# EAGLE design SI7021-V1.0 (EAGLE 6.6.0)
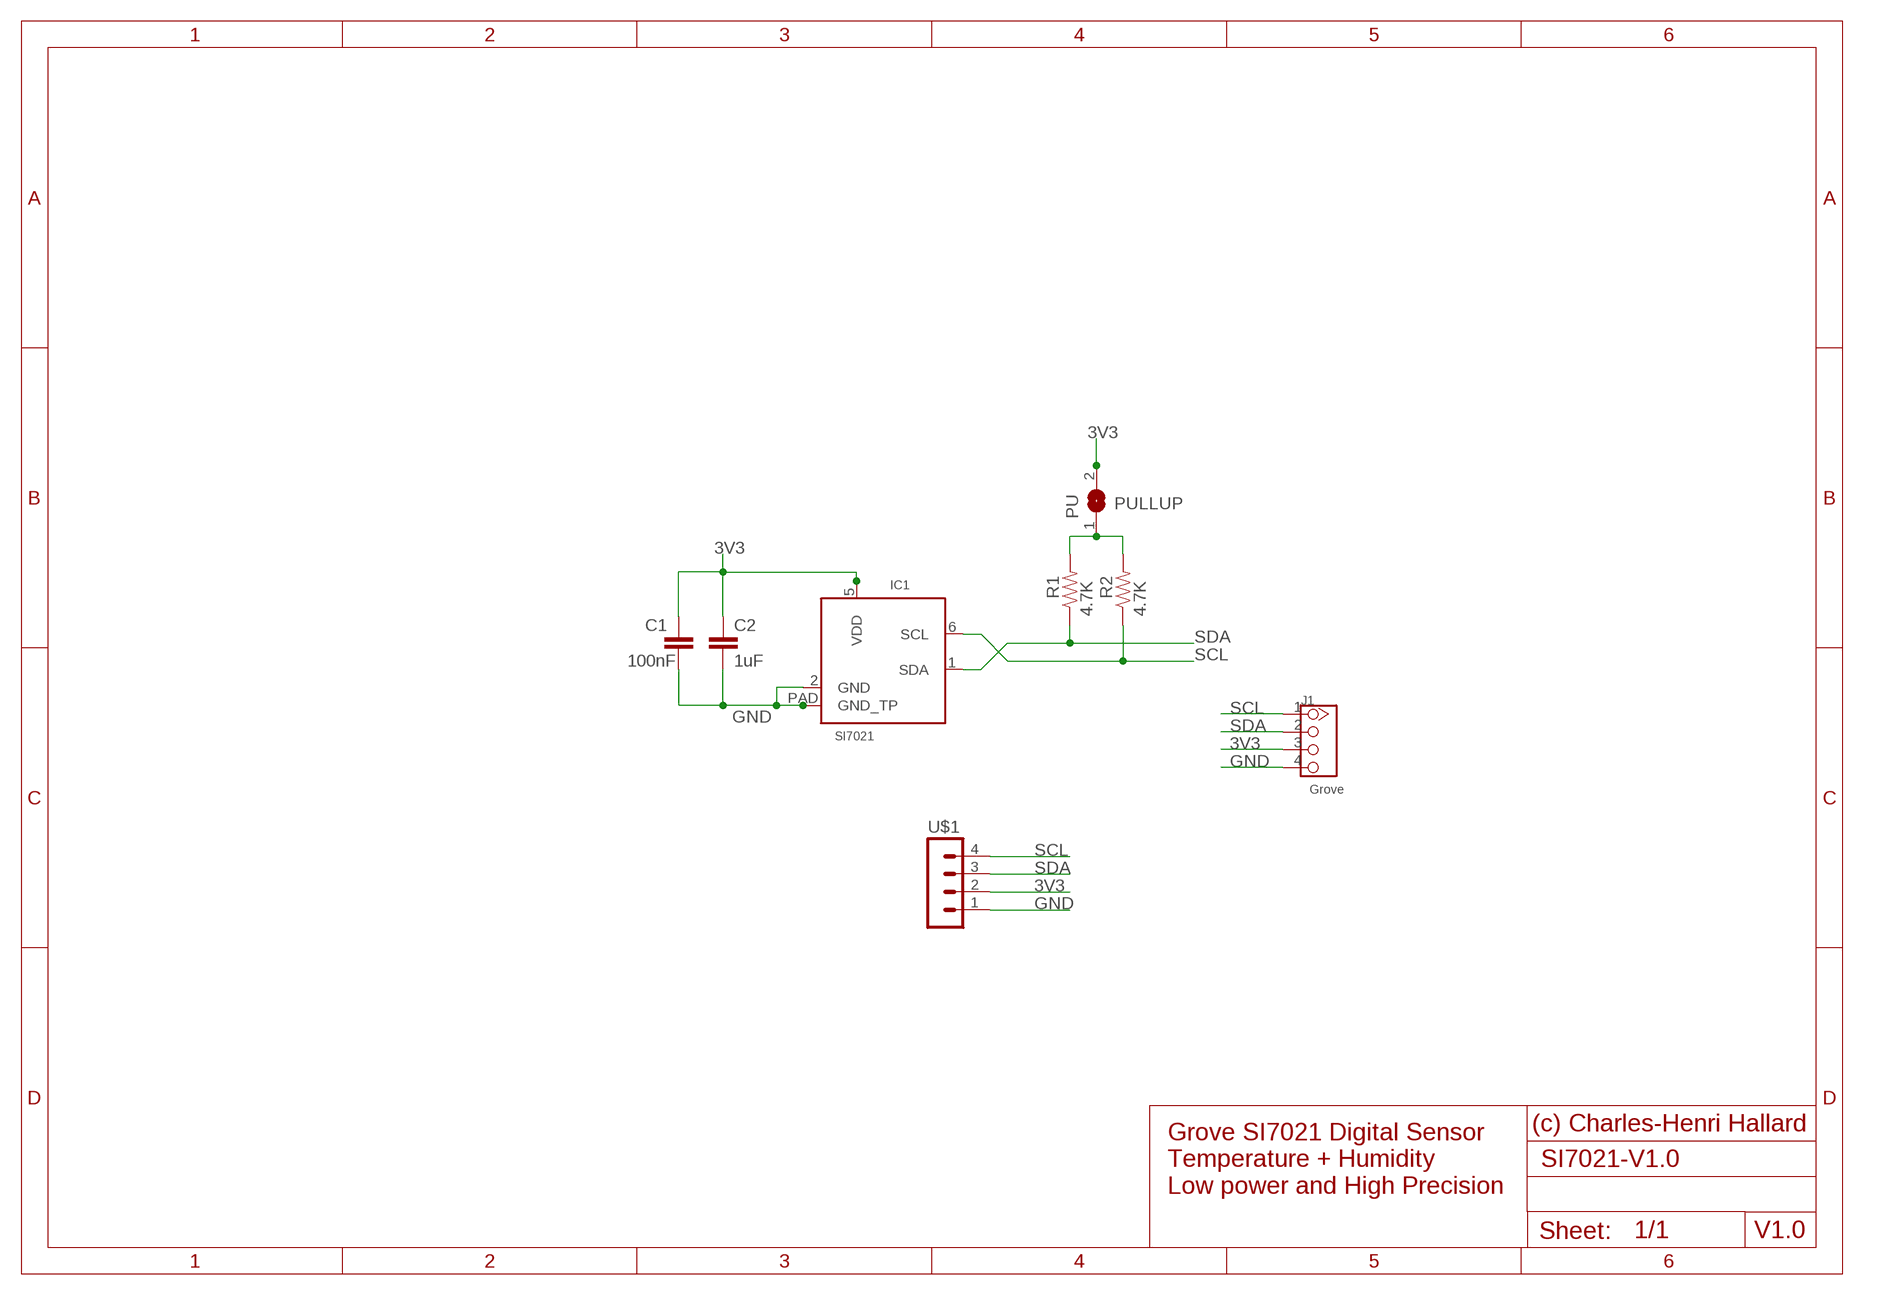
[diagram p0: schematic, sheet 1]

## Parts
C1  100nF  CAP0805-CAP  [0805-CAP]
C2  1uF  CAP0805-CAP  [0805-CAP]
IC1  SI7021  SI7020'LONG'  [DFN6-3X3-LONG]
J1  Grove  TWIG-4P-2.0-2.0  [4P-2.0]
PU  SOLDERJUMPERREFLOW_NOPASTE  [SOLDERJUMPER_REFLOW_NOPASTE]
R1  4.7K  RESISTOR0805-RES  [0805-RES]
R2  4.7K  RESISTOR0805-RES  [0805-RES]
U$1  CON_HEADER_1X04'SMALL''  [M1X4]

## Nets
3V3: C1.1 C2.1 IC1.5(VDD) J1.3 PU.2 U$1.2
GND: C1.2 C2.2 IC1.2(GND) IC1.PAD(GND_TP) J1.4 U$1.1
PULLUP: PU.1 R1.2 R2.2
SCL: IC1.6(SCL) J1.1 R2.1 U$1.4
SDA: IC1.1(SDA) J1.2 R1.1 U$1.3

## Notes on the sheet
- (c) Charles-Henri Hallard
- Grove SI7021 Digital Sensor
  Temperature + Humidity
  Low power and High Precision
- V1.0

## Library data of the parts
C1 C2 = _c2h:CAP: Capacitor Standard 0603 ceramic capacitor, and 0.1" leaded capacitor.
IC1 = _c2h:SI7020: Silicon Labs Si7020 I2C RH sensor
J1 = Connector:TWIG-4P-2.0
PU = microbuilder:SOLDERJUMPER: SMD Solder JUMPER Solder the two pads together to create a connection, or remove the solder to break it. REFLOW - Use this footprint for solder paste and reflow ovens. WAVE - Use this footprint for hand-soldering (larger pads). CLOSED - Has a trace between the two pads to ensure it is closed by default. The trace needs to be cut to disable the jumper, and can be closed again by creating a solder bridge between the two pads.
R1 R2 = _c2h:RESISTOR: Resistor Basic schematic elements and footprints for 0603, 1206, and PTH resistors.
U$1 = _c2h:CON_HEADER_1X04

## Board
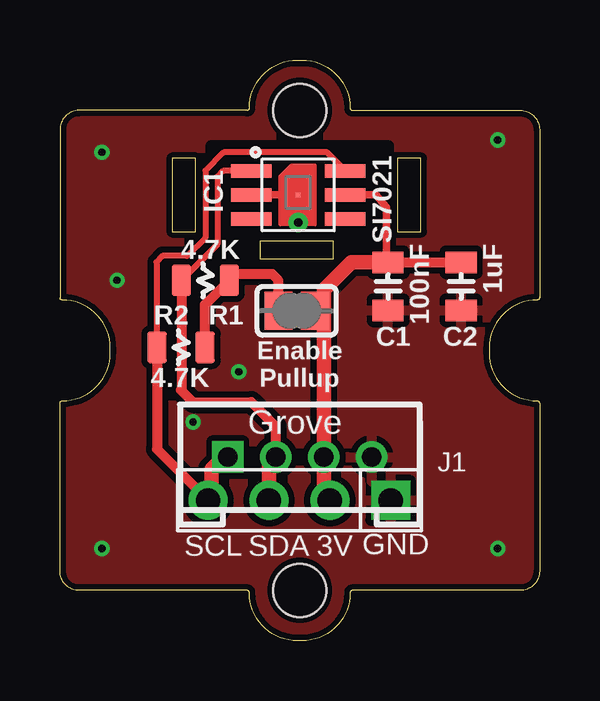
[diagram p1: board, top side]
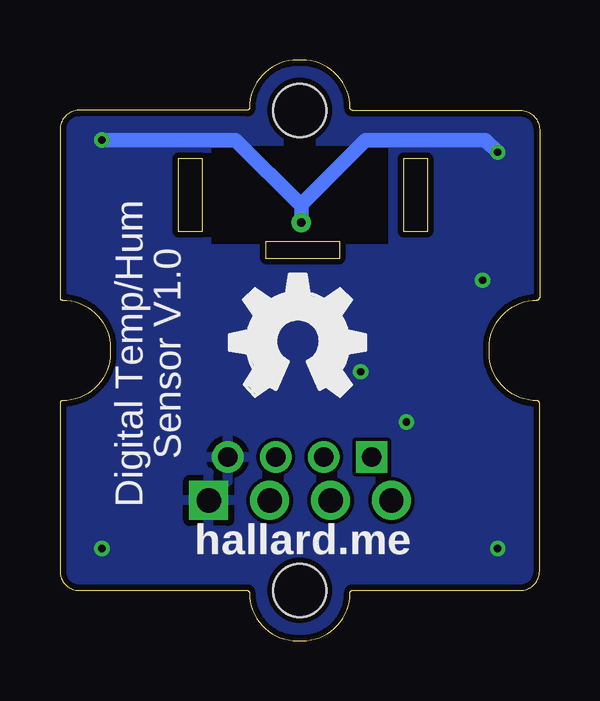
[diagram p2: board, bottom side, seen from below]

Size 20 x 24.2 mm. Coordinates in mm from the lower left corner, seen from the top.
Outline: 4.69,20.1 4.69,17.05 5.66,17.05 5.66,20.1 4.69,20.1
Outline: 14.08,20.1 14.08,17.05 15.06,17.05 15.06,20.1 14.08,20.1
Outline: 8.35,15.93 11.4,15.93 11.4,16.65 8.35,16.65 8.35,15.93
Copper layers (1*16): Top 0.035mm / dielectric 1.5mm / Bottom 0.035mm
Design rules "SeeedStudio_2layer_DRU_no_angle_20140221": minimum track width 6mil, minimum drill 12mil, track to track 6mil, track to pad 6mil, pad to pad 6mil, via to via 6mil, smd to smd 0mil, copper to edge 10mil, drill to drill 10mil, minimum pad ring 10mil, minimum via ring 6mil, stop-mask expansion 2mil, vias tented up to drill 100mil, thermal gap 10mil
tRestrict: area 6.3,16.5 to 13.7,20.6
bRestrict: area 6.3,16.5 to 13.7,20.6

### Footprints (pad centres in the part's own frame; a part is rotated, then mirrored left to right if it is on the bottom)
0805-CAP = smd 0.902 x 1.3: 1 -1,0; 2 1,0
DFN6-3X3-LONG = smd 1.702 x 0.559: 1 -1.958,1; 2 -1.958,0; 3 -1.958,-1; 4 1.958,-1; 5 1.958,0; 6 1.958,1 | smd 0.2 x 0.2: PAD 0,0
4P-2.0 = drill 0.8 pad 1.27 square: 1 -3,0 | drill 0.8 pad 1.27: 2 -1,0; 3 1,0; 4 3,0
SOLDERJUMPER_REFLOW_NOPASTE = smd 1.168 x 1.6: 1 -0.762,0; 2 0.762,0
0805-RES = smd 0.8 x 1.3: 1 -1,0; 2 1,0
M1X4 = drill 1.02 pad 1.632 square: 1 -3.81,0 | drill 1.02 pad 1.632: 2 -1.27,0; 3 1.27,0; 4 3.81,0
1U-DIM-W/-DRILL = hole 2.2: 0,-10; 0,10

### Placement (x,y rotation side)
C1  13.68,14.77 270 top
C2  16.73,14.77 270 top
IC1  9.94,18.58 0 top
J1  10,7.66 0 top
PU  9.87,13.75 0 top
R1  6.06,15.02 0 top
R2  5.05,12.23 0 top
U$1  9.99,5.85 180 top
U$2  [1U-DIM-W/-DRILL]  10,12.1 0 bottom
U$4  [OSHW_FILLX200_NOTEXT]  12.92,10.2 0 bottom

### Tracks (layer width: path | path; a pad name or v marks a point on that pad's centre or on a via)
3V3
  Top 0.305: IC1.5 13.18,18.58 13.62,18.07 13.62,15.97 | PU.2 10.75,13.75 11,13.5
  Top 0.406: C2.1 C1.1 13.68,15.91 13.62,15.97
  Top 0.61: C1.1 13.67,15.78 12.16,15.78 11,14.62 11,13.5 J1.3 11,6.11 U$1.2
GND  (via drill 0.3 pad 0.64, 0.36 pad 0.81)
  Top 0.305: IC1.2 IC1.PAD v9.94,17.43
  Bottom 0.305: 18.19,20.8 v18.26,20.86
  Bottom 0.61: v9.94,17.43 9.94,18.13 | 9.94,18.13 12.67,20.86 v18.26,20.86 | 9.94,18.13 9.94,18.2 7.27,20.86 2.25,20.86 v1.75,20.36
  other vias: 18.26,3.85 1.75,3.85 2.38,15.02 7.46,11.21 5.56,9.12
  pour Bottom: -0.79,24.8 20.8,24.8 20.8,-0.6 -0.79,-0.6
  pour Top (isolate 0.254): -0.79,24.8 20.8,24.8 20.8,-0.6 -0.79,-0.6
PULLUP
  Top 0.406: R2.2 6.05,14.01 R1.2 7.32,15.28 8.86,15.28 9.11,15.02 PU.1
SCL
  Top 0.254: IC1.6 11.9,19.6 11.14,20.36 6.83,20.36 6.06,19.59 6.06,16.8 5.3,16.04 4.29,16.04 4.03,15.78 4.03,12.24
  Top 0.406: U$1.4 4.05,7.98 R2.1 4.03,12.24
  Top 0.61: J1.1 6.83,7.66 6.32,7.15 6.32,5.99 U$1.4
SDA
  Top 0.254: IC1.1 6.81,19.58 6.57,19.34 6.57,16.53 R1.1
  Top 0.406: J1.2 9,8.93 7.98,9.94 5.56,9.94 5.05,10.45 5.06,10.46 R1.1
  Top 0.61: U$1.3 8.72,7.37 J1.2

### Text on the board
tPlace: GND | SCL | SDA | 3V
bPlace: Sensor V1.0 | Digital Temp/Hum | hallard.me
tNames: Enable / Pullup